# Altium schematic sheet Power supply UCM updated.SchDoc
size A4; SheetNumber: 3; SheetTotal: 5
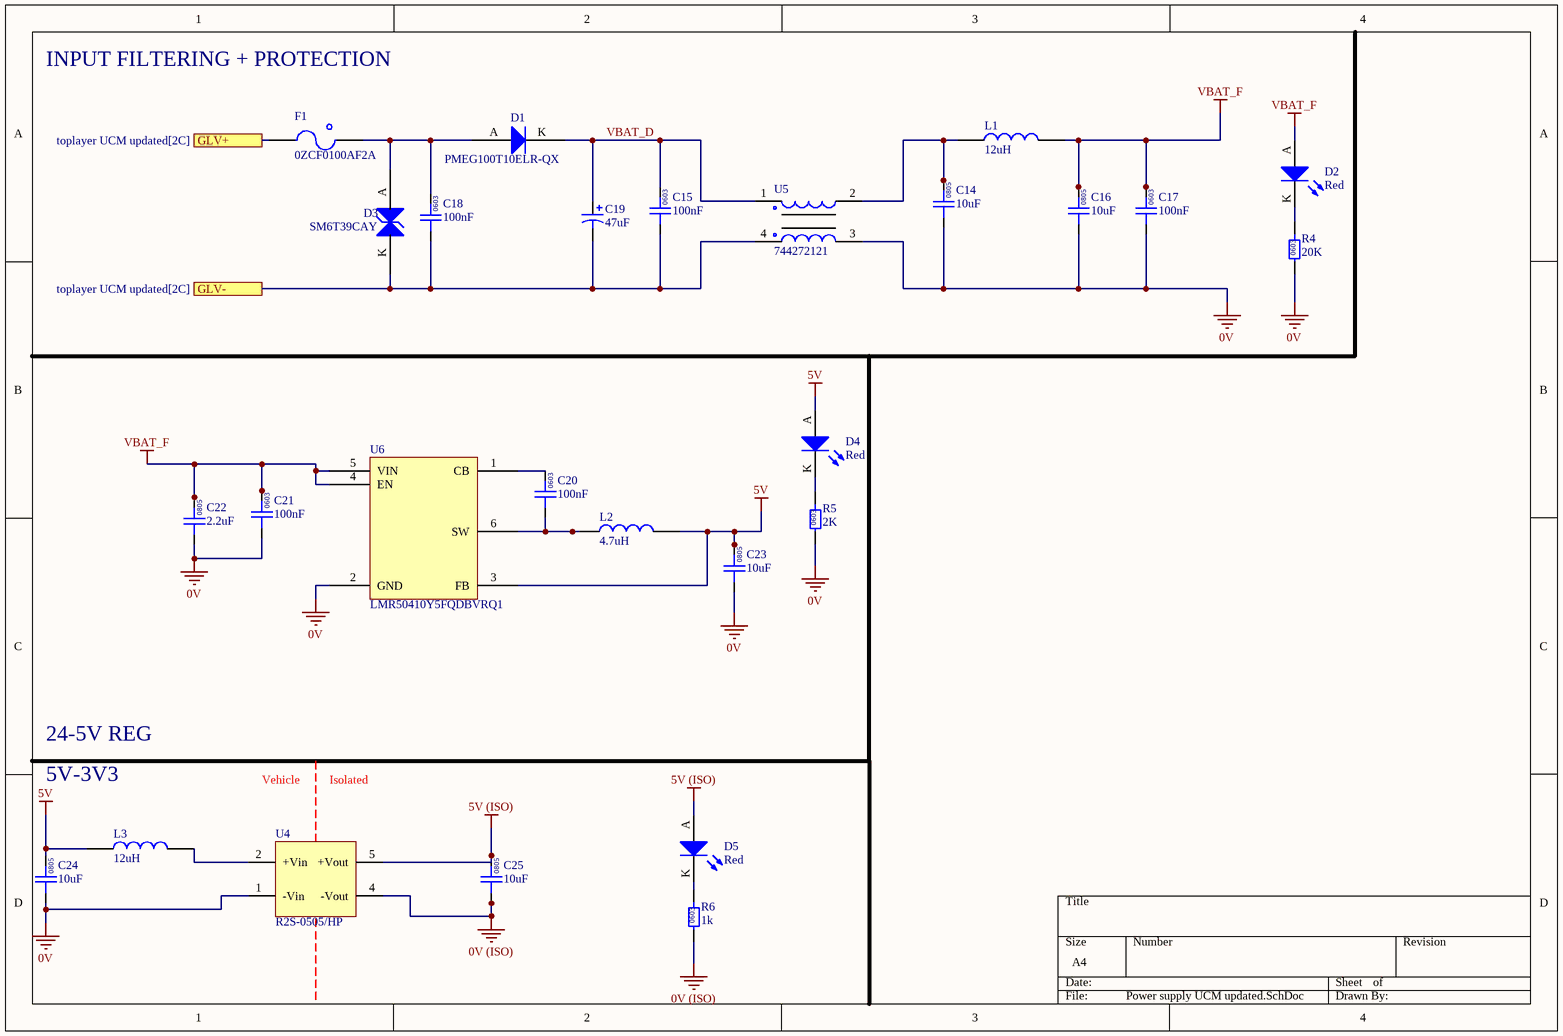
[diagram p0: Power supply UCM updated.SchDoc]

## Parts
C14  10uF  [0805]
C15  100nF  [0603]
C16  10uF  [0805]
C17  100nF  [0603]
C18  100nF  [0603]
C19  47uF  [CHEMI-CON ELCO]
C20  100nF  [0603]
C21  100nF  [0603]
C22  2.2uF  [0805]
C23  10uF  [0805]
C24  10uF  [0805]
C25  10uF  [0805]
D1  PMEG100T10ELR-QX  [SODFL350X110-2N]
D2  Red  [0805 LED]
D3  SM6T39CAY  [SM6T39CAY-Footprint-1]
D4  Red  [0805 LED]
D5  Red  [0805 LED]
F1  0ZCF0100AF2A  [2920]
L1  12uH  [1812]
L2  4.7uH  [SRN3015TA-4R7M]
L3  12uH  [1812]
R4  20K  [0603]
R5  2K  [0603]
R6  1k  [0603]
U4  R2S-0505/HP  [RECOM 8-SMD (5 Pin)]
U5  744272121  [Wurth 4-PC Pad]
U6  LMR50410Y5FQDBVRQ1  [TI-SOT23-6]

## Ports
GLV+ (see toplayer UCM updated[2C]), GLV- (see toplayer UCM updated[2C])

## Nets
0V: C14.1 C16.1 C17.1 C21.1 C22.1 C23.1 C24.1 R4.1 R5.1 U4.1(-Vin) U5.3 U6.2(GND)
0V (ISO): C25.1 R6.1 U4.4(-Vout)
5V: C23.2 C24.2 D4.A L2.1 L3.2 U6.3(FB)
5V (ISO): C25.2 D5.A U4.5(+Vout)
VBAT_F: C16.2 C17.2 C21.2 C22.2 D2.A L1.1 U6.4(EN) U6.5(VIN)
GLV+: F1.1 ; port GLV+
GLV-: C15.1 C18.1 C19.1 D3.K U5.4 ; port GLV-
VBAT_D: C15.2 C19.2 D1.K U5.1
NetC14_2: C14.2 L1.2 U5.2
NetC18_2: C18.2 D1.A D3.A F1.2
NetC20_1: C20.1 L2.2 U6.6(SW)
NetC20_2: C20.2 U6.1(CB)
NetD2_K: D2.K R4.2
NetD4_K: D4.K R5.2
NetD5_K: D5.K R6.2
NetL3_1: L3.1 U4.2(+Vin)

## Notes on the sheet
- INPUT FILTERING + PROTECTION
- 24-5V REG
- 5V-3V3
- Vehicle
- Isolated
- (in symbol GCM188L81H104KA57D) 0603
- (in symbol GRM21BR6YA106KE43L) 0805
- (in symbol GRM21BR61A226ME51L) 0805
- (in symbol RC0603FR-071KL) 0603
- (in symbol RC0603FR-072KL) 0603
- (in symbol RC0603FR-0720KL) 0603

## Library data of the parts
C14 C16 C23-C25 = GRM21BR6YA106KE43L: Manufacturer: muRata; Rated Voltage: 50V; Tolerance: 10%; Material: MLCC; Temperature Rating: X5R; Part Number: GRM21BR6YA106KE43L; Value: 10uF; Digikey Part Number: 490-10514-6-ND
C15 C17 C18 C20 C21 = GCM188L81H104KA57D: Manufacturer: muRata; Rated Voltage: 50V; Tolerance: ±10%; Material: MLCC; Temperature Rating: X8L; Part Number: GCM188L81H104KA57D; Value: 100nF; Digikey Part Number: 490-6049-1-ND
C19 = HHXA350ARA470MF61G: Part Number: HHXA350ARA470MF61G
C22 = GRM21BR61A226ME51L: Manufacturer: muRata; Value: 22uF; Rated Voltage: 50V; Tolerance: 20%; Material: MLCC; Temperature Rating: X5R; Part Number: GRM21BR61A226ME51L; Digikey Part Number: 490-10511-1-ND
D1 = CMP-004-00005-4: Diode 100 V 1A Surface Mount SOD-123W
D2 D4 D5 = SML-210LTT86: Red LED Indication - Discrete 1.75V 0805 (2012 Metric); Manufacturer: ROHM Semiconductor; Part Number: SML-210LTT86; Colour: Red; Digikey Part Number: 511-1286-1-ND
D3 = CMP-004-00003-4: TVS Diode Single Bi-Dir 33.3V 600W Automotive 2-Pin SMB T/R / TVS DIODE 33.3VWM 69.7VC SMB; Peak Pulse Current: 57A; Polarity: Bidirectional; Min Breakdown Voltage: 37.1V; Test Current: 1mA; Number of Elements: 1; Operating Supply Voltage: 30V; Diode Type: ZENER; Clamping Voltage: 53.9V; Leakage Current: 200nA; Power Line Protection: No; Max Surge Current: 11.1A; Max Breakdown Voltage: 41V; Breakdown Voltage: 39V; Max Power Dissipation: 600W; Radiation Hardening: No; Resistor Type: Zener; Termination: SMD/SMT; REACH SVHC: No SVHC; Reverse Breakdown Voltage: 37.1V; Max Operating Temperature: 150°C; Min Operating Temperature: -55°C; Element Configuration: Single; Length: 4.6mm; Case/Package: DO-214AA; Reverse Standoff Voltage: 33.3V; Number of Bidirectional Channels: 1; Number of Pins: 2; Direction: Bidirectional; Mount: Surface Mount; Package Quantity: 1; Width: 3.95mm; RoHS Compliant: Yes; Number of Channels: 1; Packaging: Tape and Reel; Max Reverse Leakage Current: 200nA; Peak Pulse Power: 600W; Height: 2.45mm; Series: Automotive, AEC-Q101, SM6TY, TRANSIL™
F1 = 0ZCF0100AF2A: PTC RESET FUSE 60V 1A 292; Manufacturer: Littelfuse Inc.; Part Number: 0ZCF0100AF2A; Digikey Part Number: 507-2070-1-ND; Digikey Link: https://www.digikey.com/product-detail/en/bel-fuse-inc/0ZCF0100AF2A/507-2070-1-ND/6210547
L1 L3 = RLS-126: Manufacturer: Recom; Tolerance: 0.2; Impedance: 230mOhm; Rated Current: 0.8 A; Material: Wirewound; Part Number: RLS-126; Value: 12uH; Digikey Part Number: 945-3429-ND
L2 = SRN4018-4R7M: Manufacturer: Bourns; Tolerance: 0.2; Impedance: 84mOhms; Rated Current: 1.9A; Material: Wirewound; Part Number: SRN4018-4R7M; Value: 4.7uH; Digikey Part Number: SRN3015TA-4R7MCT-ND
R4 = RC0603FR-0720KL: Manufacturer: YAGEO; Tolerance: 0.01; Rated Power: 0.1W; Part Number: RC0603FR-0720KL; Value: 20K; Digikey Part Number: 311-20.0KHRCT-ND; Material: FR-07
R5 = RC0603FR-072KL: Manufacturer: YAGEO; Tolerance: 0.01; Rated Power: 0.1W; Part Number: RC0603FR-072KL; Value: 2K; Digikey Part Number: 311-2.00KHRCT-ND; Material: FR-07
R6 = RC0603FR-071KL: Manufacturer: YAGEO; Tolerance: 0.01; Rated Power: 0.1W; Part Number: RC0603FR-071KL; Value: 1k; Digikey Part Number: 311-1.00KHRCT-ND; Material: FR-07
U4 = R2S-0505/HP: Isolated Module DC DC Converter 1 Output 5V 606mA 4.5V - 5.5V Input; Manufacturer: Recom; Output Power: 2W; Efficiency: 0.85; Part Number: R2S-0505/HP; Input Voltage: 4.5V-5.5V; Output Voltage: 5V; Isolation: Isolated; Digikey Part Number: 945-1764-5-ND; Digikey Link: https://www.digikey.com/product-detail/en/recom-power/R2S-0505-HP/945-1764-5-ND/2302761
U5 = 744272121: Manufacturer: Wurth Electronics Inc; Value: 120uH @ 100kHz; Impedance: 460 Ohms @ 30MHz; Rated Current: 2.5 A; Part Number: 744272121; Material: Wirewound; Digikey Part Number: 732-1489-1-ND
U6 = LMR50410-Q1: IC REG BUCK 5V 1A SOT23-6; Manufacturer: Texas Instruments; Input Voltage: 4-36V; Part Number: LMR50410-Q1; Output Voltage: 5V; Output Current: 1A; Digikey Part Number: 296-LMR50410Y5FQDBVRQ1CT-ND